# Altium schematic sheet LightSaber.SchDoc
size A3
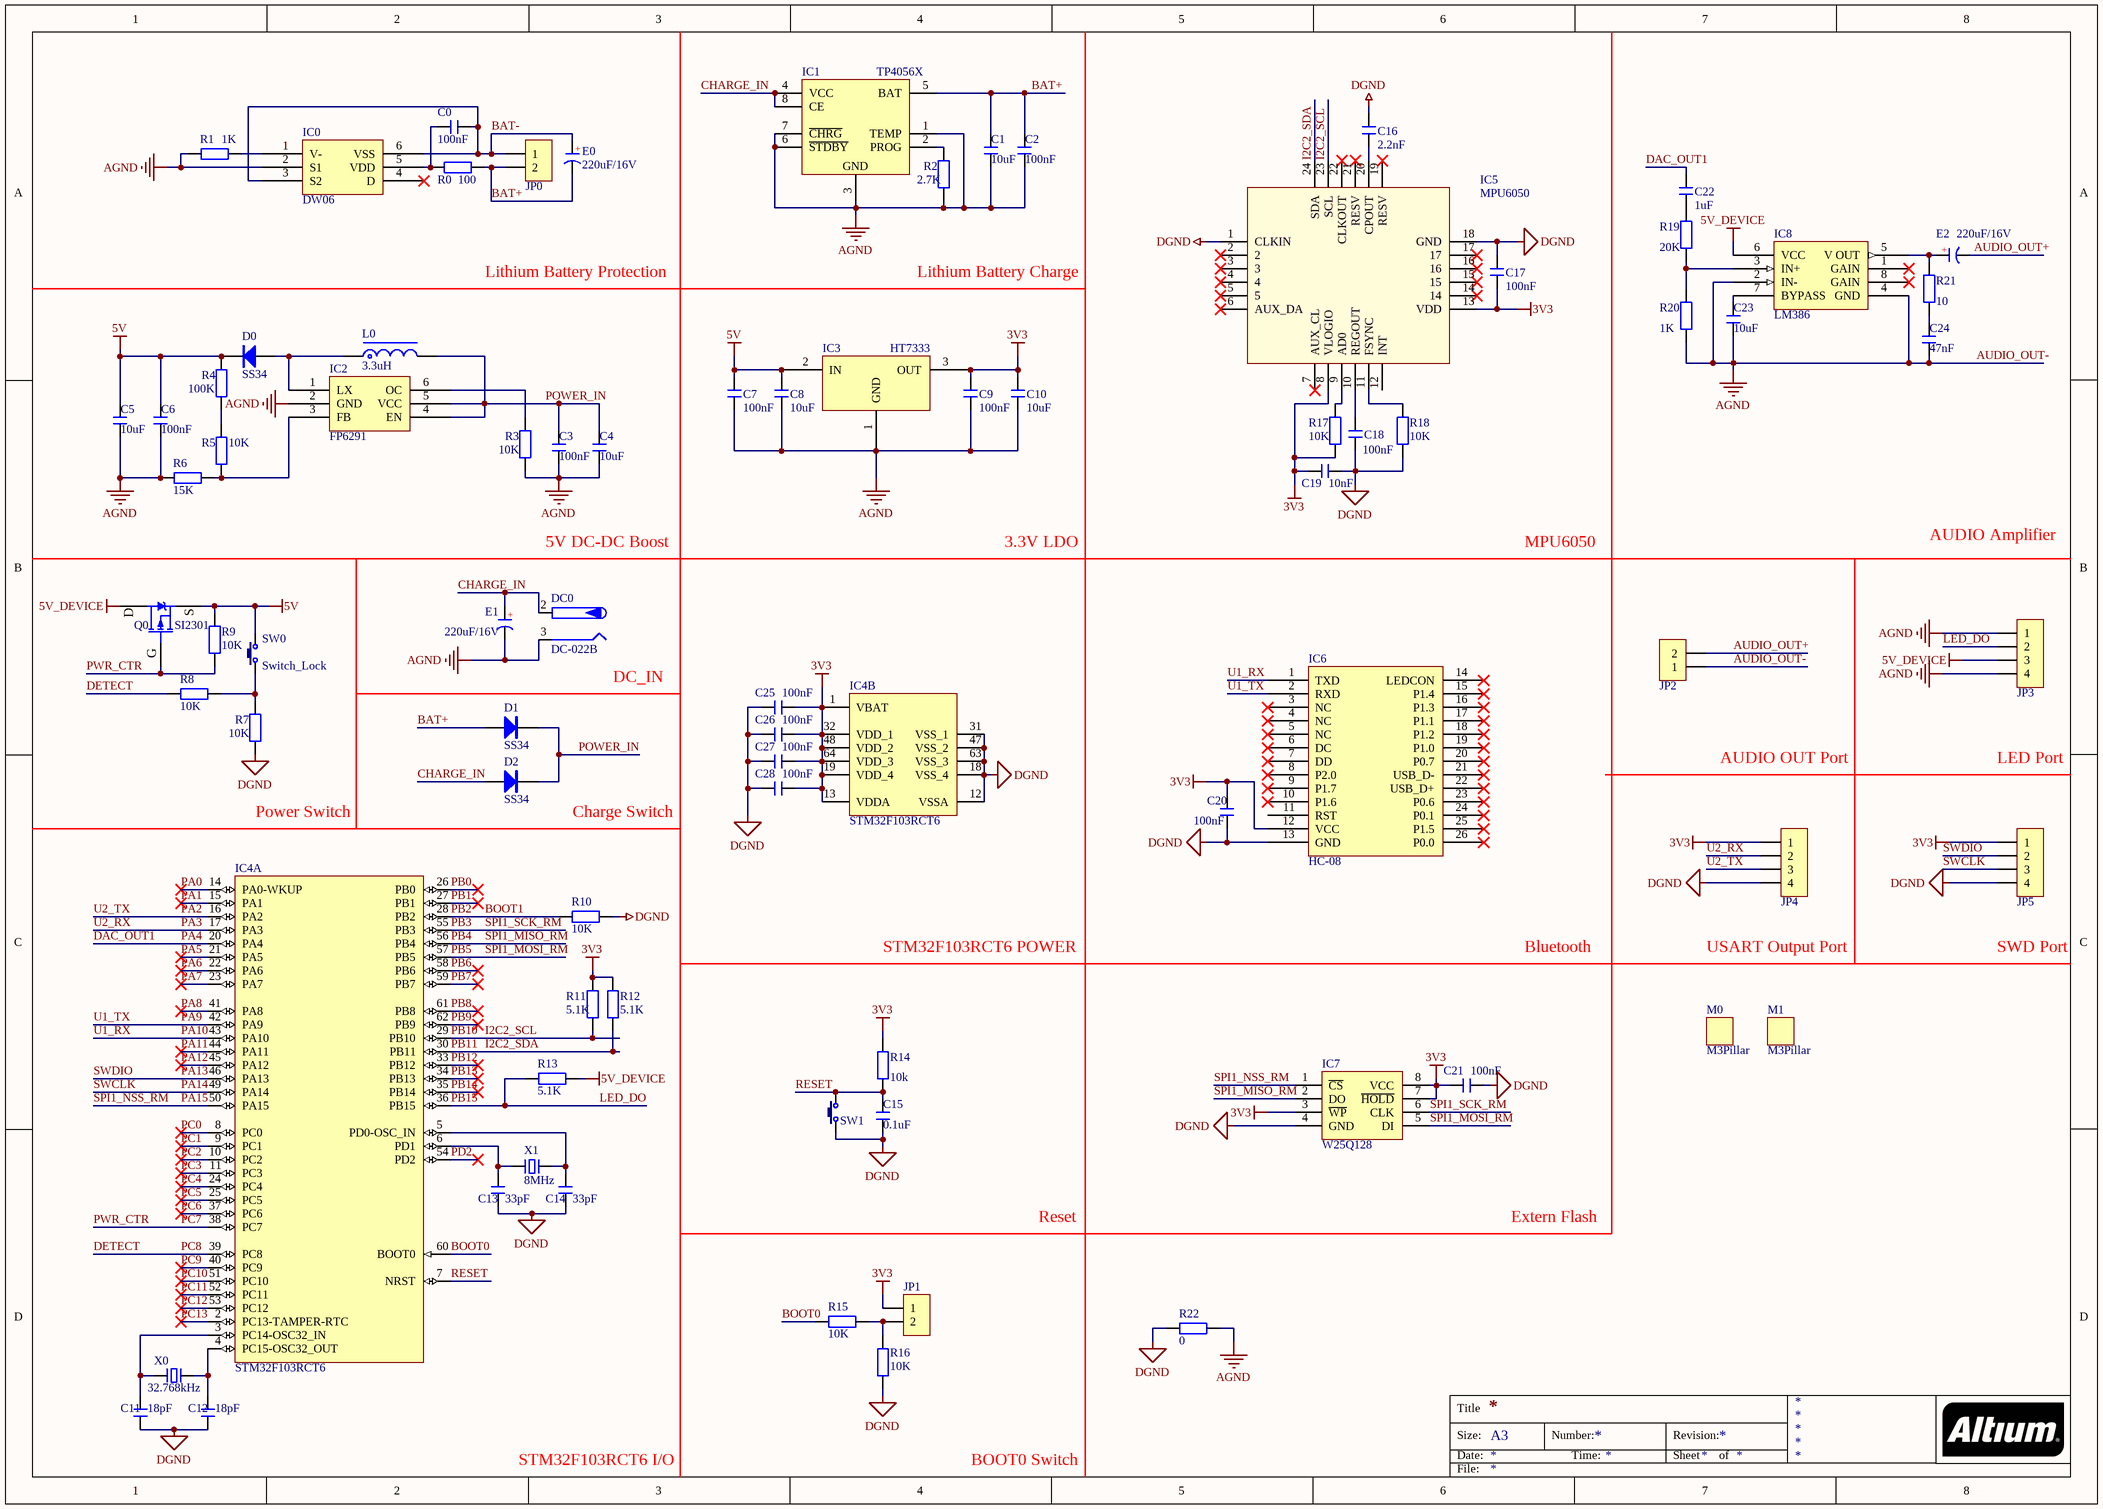
[diagram p0: LightSaber.SchDoc]

## Parts
C0  100nF  [C 0603_L]
C1  10uF  [C 0603_L]
C2  100nF  [C 0603_L]
C3  100nF  [C 0603_L]
C4  10uF  [C 0603_L]
C5  10uF  [C 0603_L]
C6  100nF  [C 0603_L]
C7  100nF  [C 0603_L]
C8  10uF  [C 0603_L]
C9  100nF  [C 0603_L]
C10  10uF  [C 0603_L]
C11  18pF  [C 0603_L]
C12  18pF  [C 0603_L]
C13  33pF  [C 0603_L]
C14  33pF  [C 0603_L]
C15  0.1uF  [C 0603_L]
C16  2.2nF  [C 0603_L]
C17  100nF  [C 0603_L]
C18  100nF  [C 0603_L]
C19  10nF  [C 0603_L]
C20  100nF  [C 0603_L]
C21  100nF  [C 0603_L]
C22  1uF  [C 0603_L]
C23  10uF  [C 0603_L]
C24  47nF  [C 0603_L]
C25  100nF  [C 0603_L]
C26  100nF  [C 0603_L]
C27  100nF  [C 0603_L]
C28  100nF  [C 0603_L]
D0  SS34  [SMA]
D1  SS34  [SMA]
D2  SS34  [SMA]
DC0  DC-022B  [DC-022B]
E0  220uF/16V  [CAP 2.5*6.3*7 - BK]
E1  220uF/16V  [CAP 2.5*6.3*7 - BK]
E2  220uF/16V  [CAP 2.5*6.3*7 - BK]
IC0  DW06  [SOT23-6N]
IC1  TP4056X  [SOP8_N]
IC2  FP6291  [SOT23-6]
IC3  HT7333  [SOT89_M]
IC4  STM32F103RCT6  [LQFP64_N]  (parts A,B of 2)
IC5  MPU6050  [QFN_24]
IC6  HC-08  [HC-08V20/22/41]
IC7  W25Q128  [SOP8W_N]
IC8  LM386  [SOP8]
JP0  HDR-1X2  [XH2.54-LI-2P]  (value not drawn)
JP1  HDR-1X2  [HDR2.54-LI-2P]  (value not drawn)
JP2  HDR-1X2  [XH2.54-LI-2P]  (value not drawn)
JP3  HDR-1X4  [XH2.54-LI-4P]  (value not drawn)
JP4  HDR-1X4  [HDR2.54-LI-4P]  (value not drawn)
JP5  HDR-1X4  [HDR2.54-LI-4P]  (value not drawn)
L0  3.3uH  [PK0406]
M0  M3Pillar  [M3x4_L]
M1  M3Pillar  [M3x4_L]
Q0  SI2301  [SOT23-3N]
R0  100  [R 0603_L]
R1  1K  [R 0603_L]
R2  2.7K  [R 0603_L]
R3  10K  [R 0603_L]
R4  100K  [R 0603_L]
R5  10K  [R 0603_L]
R6  15K  [R 0603_L]
R7  10K  [R 0603_L]
R8  10K  [R 0603_L]
R9  10K  [R 0603_L]
R10  10K  [R 0603_L]
R11  5.1K  [R 0603_L]
R12  5.1K  [R 0603_L]
R13  5.1K  [R 0603_L]
R14  10k  [R 0603_L]
R15  10K  [R 0603_L]
R16  10K  [R 0603_L]
R17  10K  [R 0603_L]
R18  10K  [R 0603_L]
R19  20K  [R 0603_L]
R20  1K  [R 0603_L]
R21  10  [R 0603_L]
R22  0  [R 0603_L]
SW0  Switch_Lock  [Switch_Lock]
SW1  3x6x5  [TSW SMD-3*6*2.5]  (value not drawn)
X0  32.768kHz  [OSC 3215-2P]
X1  8MHz  [OSC 5032-2P]

## Nets
3V3: C9.2 C10.2 C17.1 C19.1 C20.2 C21.1 C25.2 C26.2 C27.2 C28.2 IC3.3(OUT) IC4.1(VBAT) IC4.13(VDDA) IC4.19(VDD_4) IC4.32(VDD_1) IC4.48(VDD_2) IC4.64(VDD_3) IC5.8(VLOGIO) IC5.13(VDD) IC6.12(VCC) IC7.3(~{WP}) IC7.7(~{HOLD}) IC7.8(VCC) JP1.1 JP4.1 JP5.1 R11.2 R12.2 R14.2 R17.1
5V: C5.2 C6.2 C7.2 C8.2 D0.2(K) IC3.2(IN) Q0.2(S) R4.2 R9.2 SW0.2
5V_DEVICE: IC8.6(VCC) JP3.3 Q0.3(D) R13.2
AUDIO_OUT-: C1.1 C2.1 C3.1 C4.1 C5.1 C6.1 C7.1 C8.1 C9.1 C10.1 C23.1 C24.1 DC0.3 E1.2(K) IC0.2(S1) IC1.1(TEMP) IC1.3(GND) IC1.6(~{STDBY}) IC1.7(~{CHRG}) IC2.2(GND) IC3.1(GND) IC8.2(IN-) IC8.4(GND) JP2.1 JP3.1 JP3.4 R1.1 R2.1 R3.1 R6.1 R20.1 R22.2  [also labelled AGND]
DGND: C11.1 C12.1 C13.1 C14.1 C15.1 C16.2 C17.2 C18.1 C19.2 C20.1 C21.2 C25.1 C26.1 C27.1 C28.1 IC4.12(VSSA) IC4.18(VSS_4) IC4.31(VSS_1) IC4.47(VSS_2) IC4.63(VSS_3) IC5.1(CLKIN) IC5.18(GND) IC6.13(GND) IC7.4(GND) JP4.4 JP5.4 R7.1 R10.2 R16.2 R18.1 R22.1 SW1.1
AUDIO_OUT+: E2.2(K) JP2.2
BAT+: C1.2 C2.2 D1.1(A) E0.2(K) IC1.5(BAT) JP0.2 R0.2
BAT-: C0.2 E0.1(A) IC0.3(S2) IC0.6(VSS) JP0.1
BOOT0: IC4.60(BOOT0) R15.2
BOOT1: IC4.28(PB2) R10.1  [also labelled PB2]
CHARGE_IN: D2.1(A) DC0.2 E1.1(A) IC1.4(VCC) IC1.8(CE)
DAC_OUT1: C22.2 IC4.20(PA4)  [also labelled PA4]
DETECT: IC4.39(PC8) R8.1  [also labelled PC8]
I2C2_SCL: IC4.29(PB10) IC5.23(SCL) R11.1  [also labelled PB10]
I2C2_SDA: IC4.30(PB11) IC5.24(SDA) R12.1  [also labelled PB11]
LED_DO: IC4.36(PB15) JP3.2 R13.1  [also labelled PB15]
PA0: IC4.14(PA0-WKUP)
PA1: IC4.15(PA1)
PA2: IC4.16(PA2) JP4.3  [also labelled U2_TX]
PA3: IC4.17(PA3) JP4.2  [also labelled U2_RX]
PA5: IC4.21(PA5)
PA6: IC4.22(PA6)
PA7: IC4.23(PA7)
PA8: IC4.41(PA8)
PA9: IC4.42(PA9) IC6.2(RXD)  [also labelled U1_TX]
PA10: IC4.43(PA10) IC6.1(TXD)  [also labelled U1_RX]
PA11: IC4.44(PA11)
PA12: IC4.45(PA12)
PA13: IC4.46(PA13) JP5.2  [also labelled SWDIO]
PA14: IC4.49(PA14) JP5.3  [also labelled SWCLK]
PA15: IC4.50(PA15) IC7.1(~{CS})  [also labelled SPI1_NSS_RM]
PB0: IC4.26(PB0)
PB1: IC4.27(PB1)
PB3: IC4.55(PB3) IC7.6(CLK)  [also labelled SPI1_SCK_RM]
PB4: IC4.56(PB4) IC7.2(DO)  [also labelled SPI1_MISO_RM]
PB5: IC4.57(PB5) IC7.5(DI)  [also labelled SPI1_MOSI_RM]
PB6: IC4.58(PB6)
PB7: IC4.59(PB7)
PB8: IC4.61(PB8)
PB9: IC4.62(PB9)
PB12: IC4.33(PB12)
PB13: IC4.34(PB13)
PB14: IC4.35(PB14)
PC0: IC4.8(PC0)
PC1: IC4.9(PC1)
PC2: IC4.10(PC2)
PC3: IC4.11(PC3)
PC4: IC4.24(PC4)
PC5: IC4.25(PC5)
PC6: IC4.37(PC6)
PC7: IC4.38(PC7) Q0.1(G) R9.1  [also labelled PWR_CTR]
PC9: IC4.40(PC9)
PC10: IC4.51(PC10)
PC11: IC4.52(PC11)
PC12: IC4.53(PC12)
PC13: IC4.2(PC13-TAMPER-RTC)
PD2: IC4.54(PD2)
POWER_IN: C3.2 C4.2 D1.2(K) D2.2(K) IC2.4(EN) IC2.5(VCC) L0.2
RESET: C15.2 IC4.7(NRST) R14.1 SW1.2
NetC0_1: C0.1 IC0.5(VDD) R0.1
NetC11_2: C11.2 IC4.3(PC14-OSC32_IN) X0.1
NetC12_2: C12.2 IC4.4(PC15-OSC32_OUT) X0.2
NetC13_2: C13.2 IC4.6(PD1) X1.1
NetC14_2: C14.2 IC4.5(PD0-OSC_IN) X1.2
NetC16_1: C16.1 IC5.20(CPOUT)
NetC18_2: C18.2 IC5.10(REGOUT)
NetC22_1: C22.1 R19.2
NetC23_2: C23.2 IC8.7(BYPASS)
NetC24_2: C24.2 R21.1
NetD0_1: D0.1(A) IC2.1(LX) L0.1
NetE2_1: E2.1(A) IC8.5(V_OUT) R21.2
NetIC0_1: IC0.1(V-) R1.2
NetIC1_2: IC1.2(PROG) R2.2
NetIC2_3: IC2.3(FB) R5.1 R6.2
NetIC2_6: IC2.6(OC) R3.2
NetIC5_9: IC5.9(AD0) R17.2
NetIC5_11: IC5.11(FSYNC) R18.2
NetIC8_3: IC8.3(IN+) R19.1 R20.2
NetJP1_2: JP1.2 R15.1 R16.1
NetR4_1: R4.1 R5.2
NetR7_2: R7.2 R8.2 SW0.1

Not connected (* = marked no-connect by the designer): IC0 4(D)*; IC5 2* 3* 4* 5* 6(AUX_DA)* 7(AUX_CL)* 12(INT) 14* 15* 16* 17* 19(RESV)* 21(RESV)* 22(CLKOUT)*; IC6 3(NC)* 4(NC)* 5(NC)* 6(DC)* 7(DD)* 8(P2.0)* 9(P1.7)* 10(P1.6)* 11(RST) 14(LEDCON)* 15(P1.4)* 16(P1.3)* 17(P1.1)* 18(P1.2)* 19(P1.0)* 20(P0.7)* 21(USB_D-)* 22(USB_D+)* 23(P0.6)* 24(P0.1)* 25(P1.5)* 26(P0.0)*; IC8 1(GAIN)* 8(GAIN)*

## Notes on the sheet
- Lithium Battery Protection
- Lithium Battery Charge
- 5V DC-DC Boost
- 3.3V LDO
- MPU6050
- AUDIO Amplifier
- DC_IN
- AUDIO OUT Port
- LED Port
- Power Switch
- Charge Switch
- STM32F103RCT6 POWER
- Bluetooth
- USART Output Port
- SWD Port
- Reset
- Extern Flash
- STM32F103RCT6 I/O
- BOOT0 Switch
- Title
- Size:
- Date:
- A3
- Number:
- Time:
- Revision:
- Sheet
- of
- File:
- (in symbol C-CAP) +

## Library data of the parts
C0-C28 = C: 无极性贴片电容; 淘宝ID: 黄晶宝石; BOM名称: 无极性贴片电容; 学习资源: https://shop463601444.taobao.com
D0-D2 = SS34: 肖特基二极管; 属性: 40V/3A; BOM名称: 肖特基二极管; 学习资源: https://shop463601444.taobao.com
E0-E2 = C-CAP: 直插电解电容; 淘宝ID: 黄晶宝石; BOM名称: 直插电解电容; 学习资源: https://shop463601444.taobao.com
IC1 = TP4056: 锂电池充电管理; 淘宝ID: 黄晶宝石; BOM名称: 锂电池充电管理; 学习资源: https://shop463601444.taobao.com
IC4 = STM32F103RCT6: STM32 ARM-based 32-bit MCU Performance Line with 256 kB Flash, 48 kB Internal RAM, -40 to +85癈 Temperature, 64-Pin LQFP, Tray; DatasheetVersion: rev8.0, Apr-2011; PackageVersion: rev13, Apr-2011; PackageReference: LQFP64; PackageDescription: 64-Pin Low-Profile Quad Flat Pack, 10 x 10 mm Body, 0.5 mm Pitch (LQFP64); ComponentLink1Description: Manufacturer URL; ComponentLink1URL: http://www.st.com/; ComponentLink2Description: STM32F103 Datasheet; ComponentLink2URL: http://www.st.com/internet/com/TECHNICAL_RESOURCES/TECHNICAL_LITERATURE/DATASHEET/CD00191185.pdf; ComponentLink3Description: STM32 Family Web Page; ComponentLink3URL: www.st.com/stm32
IC5 = MPU6050: 三轴加速度+三轴陀螺仪
IC7 = W25Qxx: 外置Flash; 版权归属: 源创客; BOM名称: 外置Flash; 学习资源: www.ooocke.com
JP0-JP2 = Header 2: 2P接插件; 版权归属: 源创客; BOM名称: 2P接插件; 学习资源: www.ooocke.com
JP3-JP5 = Header 4: 4P接插件; 版权归属: 源创客; BOM名称: 4P接插件; 学习资源: www.ooocke.com
L0 = L-PK: 工字电感; 淘宝ID: 源创客; BOM名称: 工字电感; 学习资源: www.ooocke.com
Q0 = SI2301: P沟道场效应管; BOM名称: P沟道场效应管; 学习资源: https://shop463601444.taobao.com
R0-R22 = R: 贴片电阻; 版权归属: 黄晶宝石; BOM名称: 贴片电阻; 学习资源: https://shop463601444.taobao.com
SW1 = TSW 3x6: 3x6轻触开关; 版权归属: 源创客; BOM名称: 3x6轻触开关; 学习资源: www.ooocke.com
X0 X1 = XTAL-2P: 2脚无源脚晶振; 版权归属: 源创客; BOM名称: 2脚无源脚晶振; 学习资源: www.ooocke.com